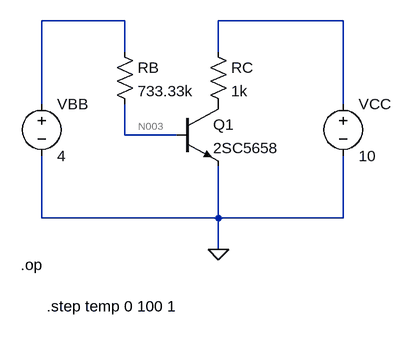
[diagram p0: schematic cirSinRE.asc]
cirSinRE.asc, the LTspice schematic file:
Version 4.1
SHEET 1 880 680
WIRE 64 -16 -64 -16
WIRE 400 -16 208 -16
WIRE 64 32 64 -16
WIRE 208 32 208 -16
WIRE -64 112 -64 -16
WIRE 400 112 400 -16
WIRE 64 160 64 112
WIRE 144 160 64 160
WIRE -64 288 -64 192
WIRE 208 288 208 208
WIRE 208 288 -64 288
WIRE 400 288 400 192
WIRE 400 288 208 288
WIRE 208 336 208 288
FLAG 208 336 0
SYMBOL npn 144 112 R0
SYMATTR InstName Q1
SYMATTR Value 2SC5658
SYMBOL res 192 16 R0
SYMATTR InstName RC
SYMATTR Value 1k
SYMBOL res 48 16 R0
SYMATTR InstName RB
SYMATTR Value 733.33k
SYMBOL voltage -64 96 R0
WINDOW 123 0 0 Left 0
WINDOW 39 0 0 Left 0
SYMATTR InstName VBB
SYMATTR Value 4
SYMBOL voltage 400 96 R0
WINDOW 123 0 0 Left 0
WINDOW 39 0 0 Left 0
SYMATTR InstName VCC
SYMATTR Value 10
TEXT -96 360 Left 2 !.op
TEXT -56 424 Left 2 !.step temp 0 100 1

The netlist it stands for:
* cirSinRE.asc
Q1 P001 N003 0 0 2SC5658
RC N002 P001 1k
RB N001 N003 733.33k
VBB N001 0 4
VCC N002 0 10
.model NPN NPN
.model PNP PNP
.lib standard.bjt
.op
.step temp 0 100 1
.backanno
.end

* Results of the author's LTspice run, read from the files saved beside the schematic
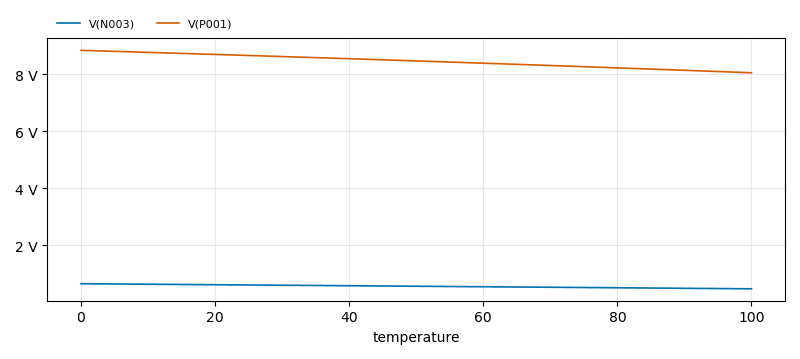
[diagram p1: Operating Point of cirSinRE.asc, plotted from the saved traces]
* Operating Point, 1 run:
*   V(N003): 659.2 mV at temperature=0, 480.9 mV at temperature=100 , min 480.9 mV, max 659.2 mV
*   V(P001): 8.84 V at temperature=0, 8.055 V at temperature=100 , min 8.055 V, max 8.84 V